# Altium schematic sheet COUNTER_BANK.SchDoc
size A; DocumentNumber: 10; SheetNumber: 10; SheetTotal: 13
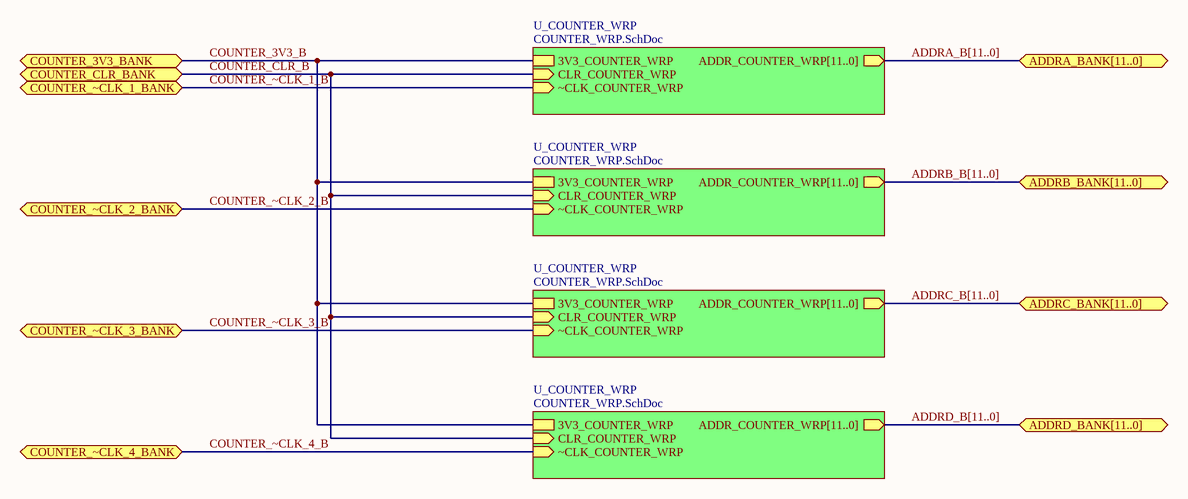
[diagram p0: COUNTER_BANK.SchDoc]

## Sub-sheets
U_COUNTER_WRP = COUNTER_WRP.SchDoc: ADDR_COUNTER_WRP[11..0], 3V3_COUNTER_WRP, CLR_COUNTER_WRP, ~CLK_COUNTER_WRP
U_COUNTER_WRP = COUNTER_WRP.SchDoc: ADDR_COUNTER_WRP[11..0], 3V3_COUNTER_WRP, CLR_COUNTER_WRP, ~CLK_COUNTER_WRP
U_COUNTER_WRP = COUNTER_WRP.SchDoc: ADDR_COUNTER_WRP[11..0], 3V3_COUNTER_WRP, CLR_COUNTER_WRP, ~CLK_COUNTER_WRP
U_COUNTER_WRP = COUNTER_WRP.SchDoc: ADDR_COUNTER_WRP[11..0], 3V3_COUNTER_WRP, CLR_COUNTER_WRP, ~CLK_COUNTER_WRP

## Ports
ADDRA_BANK[11..0], ADDRB_BANK[11..0], ADDRC_BANK[11..0], ADDRD_BANK[11..0], COUNTER_3V3_BANK, COUNTER_CLR_BANK, COUNTER_~CLK_1_BANK, COUNTER_~CLK_2_BANK, COUNTER_~CLK_3_BANK, COUNTER_~CLK_4_BANK

## Nets
COUNTER_3V3_B: port COUNTER_3V3_BANK, sheet U_COUNTER_WRP/3V3_COUNTER_WRP, sheet U_COUNTER_WRP/3V3_COUNTER_WRP, sheet U_COUNTER_WRP/3V3_COUNTER_WRP, sheet U_COUNTER_WRP/3V3_COUNTER_WRP
COUNTER_CLR_B: port COUNTER_CLR_BANK, sheet U_COUNTER_WRP/CLR_COUNTER_WRP, sheet U_COUNTER_WRP/CLR_COUNTER_WRP, sheet U_COUNTER_WRP/CLR_COUNTER_WRP, sheet U_COUNTER_WRP/CLR_COUNTER_WRP
COUNTER_~CLK_1_B: port COUNTER_~CLK_1_BANK, sheet U_COUNTER_WRP/~CLK_COUNTER_WRP
COUNTER_~CLK_2_B: port COUNTER_~CLK_2_BANK, sheet U_COUNTER_WRP/~CLK_COUNTER_WRP
COUNTER_~CLK_3_B: port COUNTER_~CLK_3_BANK, sheet U_COUNTER_WRP/~CLK_COUNTER_WRP
COUNTER_~CLK_4_B: port COUNTER_~CLK_4_BANK, sheet U_COUNTER_WRP/~CLK_COUNTER_WRP

## Buses and harness runs
bus ADDRA_B[11..0] = port ADDRA_BANK[11..0] = sheet U_COUNTER_WRP/ADDR_COUNTER_WRP[11..0]
bus ADDRB_B[11..0] = port ADDRB_BANK[11..0] = sheet U_COUNTER_WRP/ADDR_COUNTER_WRP[11..0]
bus ADDRC_B[11..0] = port ADDRC_BANK[11..0] = sheet U_COUNTER_WRP/ADDR_COUNTER_WRP[11..0]
bus ADDRD_B[11..0] = port ADDRD_BANK[11..0] = sheet U_COUNTER_WRP/ADDR_COUNTER_WRP[11..0]